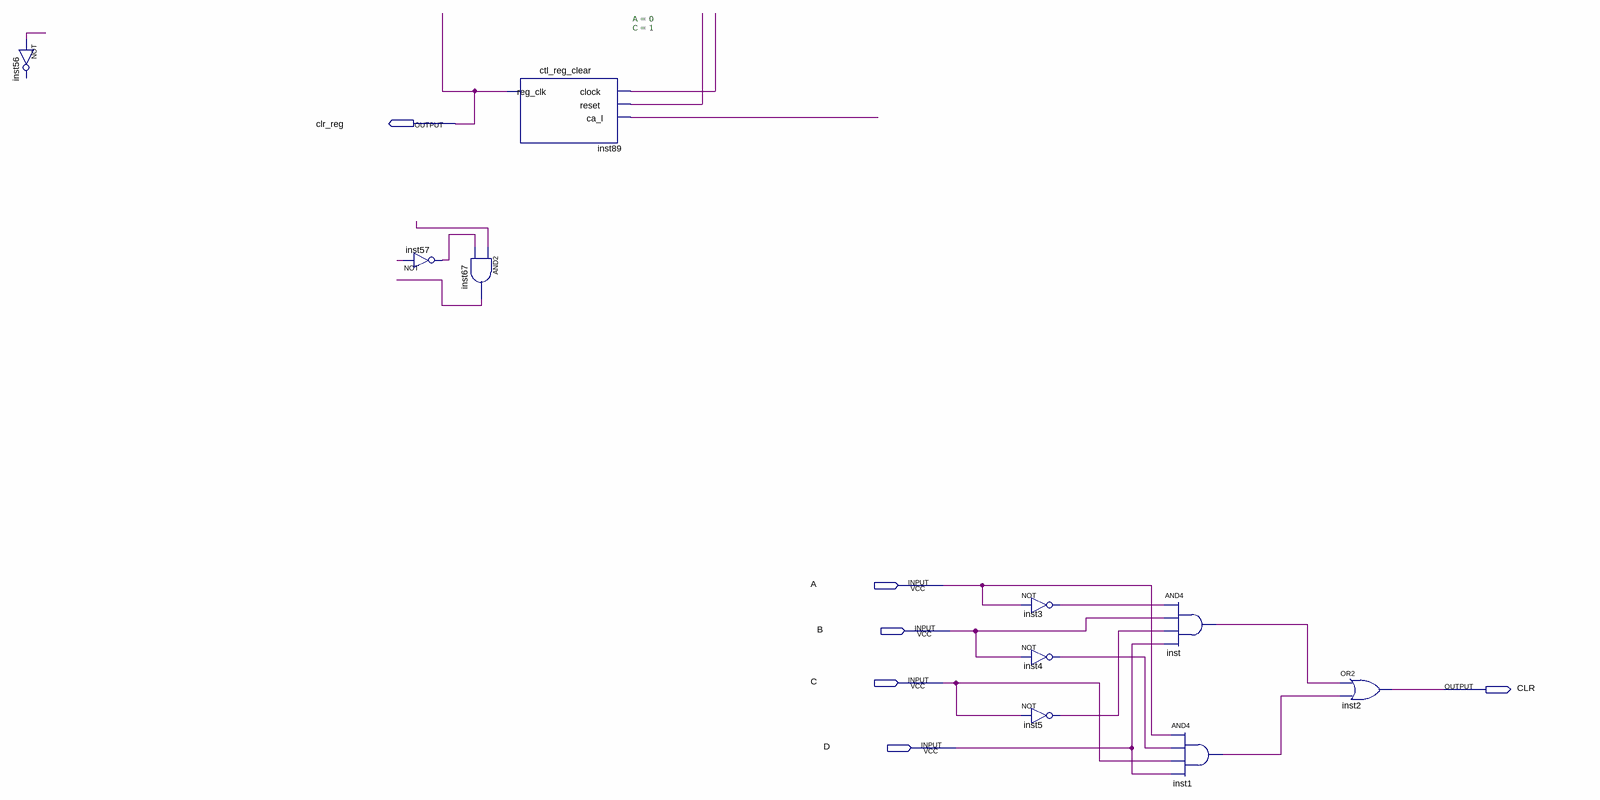
[diagram p0: schematic sheet]
// Quartus schematic components.bdf as structural Verilog: 10 symbols, 6 pins
module components (
  input  A,
  input  B,
  input  C,
  input  D,
  output clr_reg,
  output CLR
);

  wire inst1_out, inst3_out, inst4_out, inst5_out, inst57_out, inst67_out, inst_out, undriven, undriven_2,
       undriven_3, undriven_4, undriven_5, undriven_6;

  // NOT inst56 has open pins: IN=undriven, OUT=open
  not inst57 (inst57_out, undriven_3);
  and inst67 (inst67_out, undriven_2, inst57_out);
  ctl_reg_clear #(.A(0), .C(1)) inst89 (.clock(undriven_4), .reset(undriven_5), .ca_l(undriven_6), .reg_clk(clr_reg));
  not inst3 (inst3_out, A);
  not inst4 (inst4_out, B);
  not inst5 (inst5_out, C);
  and inst (inst_out, inst3_out, B, inst5_out, D);
  and inst1 (inst1_out, A, inst4_out, C, D);
  or inst2 (CLR, inst_out, inst1_out);
endmodule
